# EasyEDA schematic Biped Motor Control Board.json
TITLE: Sheet_1; REV: 1.0; Date: 2019-03-02; Sheet: 1/1; Drawn By: anand1997; Company: Your Company
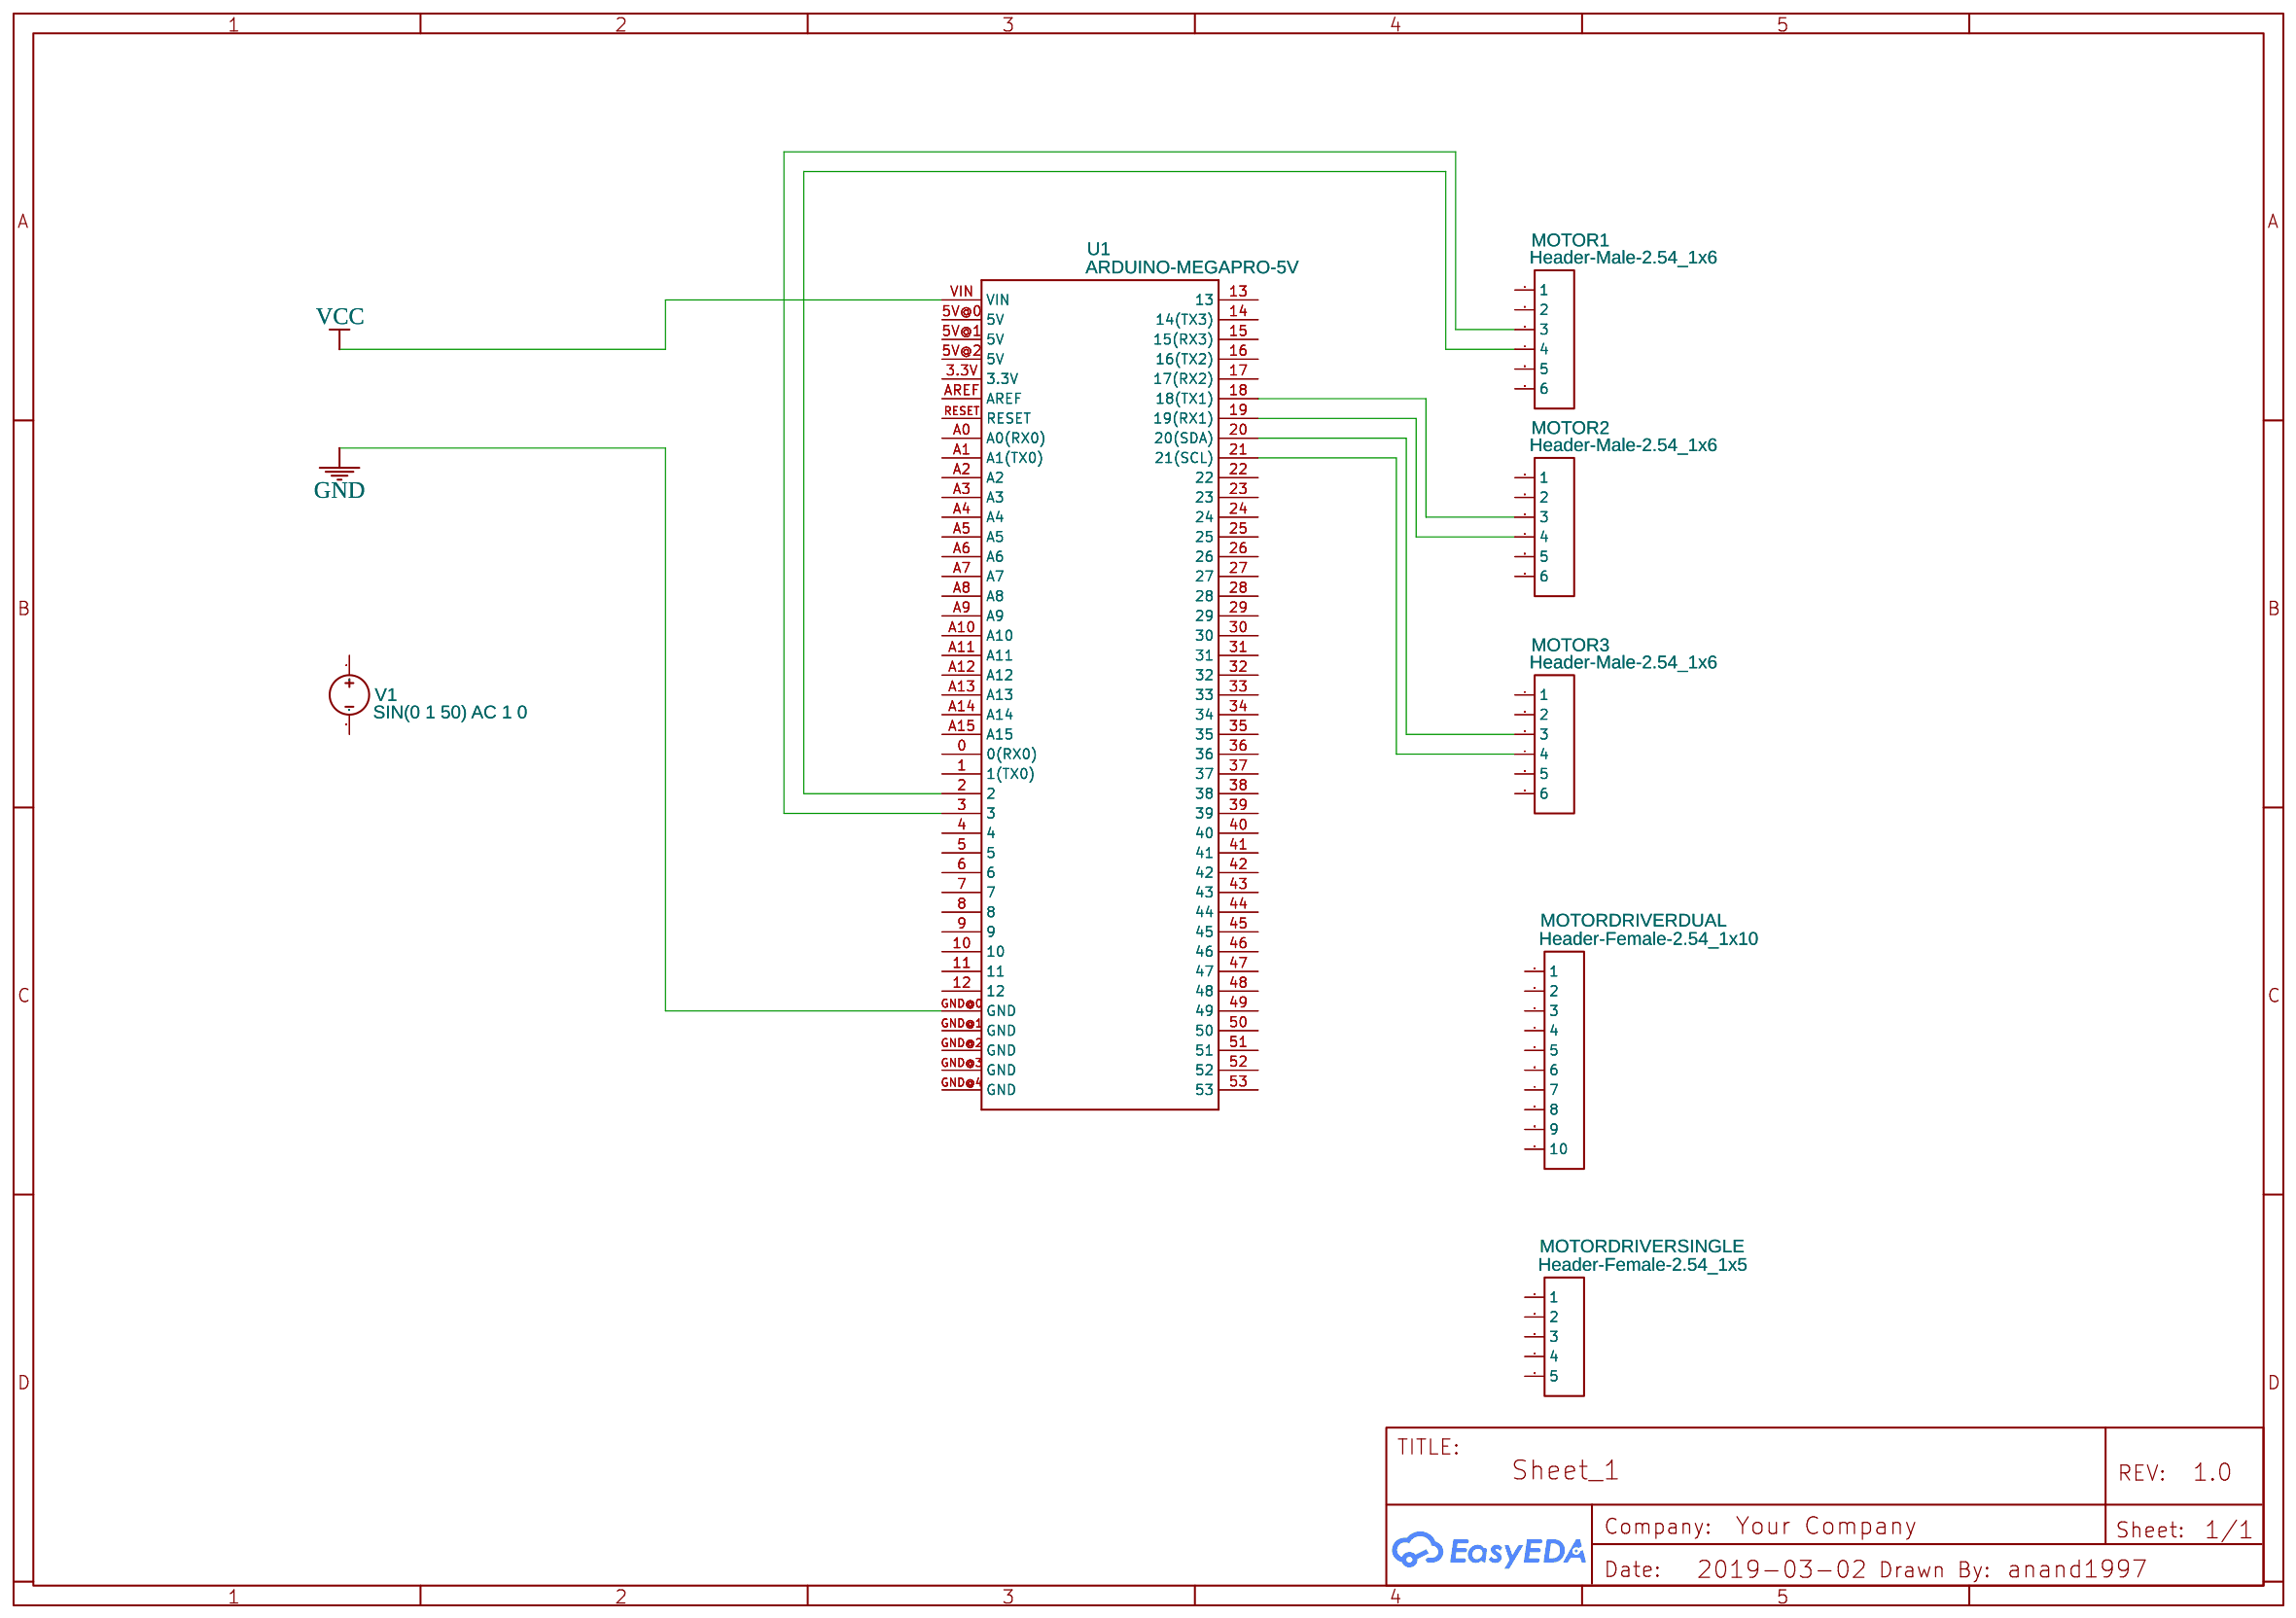
[diagram p0: schematic sheet]

## Parts
MOTOR1  Header-Male-2.54_1x6  [HDR-6X1/2.54]
MOTOR2  Header-Male-2.54_1x6  [HDR-6X1/2.54]
MOTOR3  Header-Male-2.54_1x6  [HDR-6X1/2.54]
MOTORDRIVERDUAL  Header-Female-2.54_1x10  [HDR-10X1/2.54]
MOTORDRIVERSINGLE  Header-Female-2.54_1x5  [HDR-5X1/2.54]
U1  ARDUINO-MEGAPRO-5V  [ARDUINO_MEGA-PRO-5V]
V1  SIN(0 1 50) AC 1 0  [HDR1X2]

## Library data of the parts
MOTOR1-MOTOR3 = -: Supplier: LCSC; Manufacturer: BOOMELE; Supplier Part: C37208
MOTORDRIVERDUAL = -: Supplier: LCSC; Manufacturer: BOOMELE; Manufacturer Part: 2.54mm 1*10P Straight Female header Gold-plated; Supplier Part: C35445
MOTORDRIVERSINGLE = -: Supplier: LCSC; Manufacturer: BOOMELE; Manufacturer Part: 2.54mm 1*5p Female header; image: //image.lceda.cn/szlcsc/C50950.jpg; Supplier Part: C50950
U1 = -: Arduino Mega board footprint; Contributor: SparkFun; Manufacturer Part: ?
V1 = Vsin: Manufacturer Part: ?

## Nets
GND: U1.GND@0(GND)
VCC: U1.VIN
Net-(MOTOR1-3): MOTOR1.3 U1.3
Net-(MOTOR1-4): MOTOR1.4 U1.2
Net-(MOTOR2-3): MOTOR2.3 U1.18(18(TX1))
Net-(MOTOR2-4): MOTOR2.4 U1.19(19(RX1))
Net-(MOTOR3-3): MOTOR3.3 U1.20(20(SDA))
Net-(MOTOR3-4): MOTOR3.4 U1.21(21(SCL))

Not connected (* = marked no-connect by the designer): MOTOR1 1 2 5 6; MOTOR2 1 2 5 6; MOTOR3 1 2 5 6; MOTORDRIVERDUAL 1 2 3 4 5 6 7 8 9 10; MOTORDRIVERSINGLE 1 2 3 4 5; U1 0(0(RX0)) 1(1(TX0)) 3.3V 4 5 5V@0(5V) 5V@1(5V) 5V@2(5V) 6 7 8 9 10 11 12 13 14(14(TX3)) 15(15(RX3)) 16(16(TX2)) 17(17(RX2)) 22 23 24 25 26 27 28 29 30 31 32 33 34 35 36 37 38 39 40 41 42 43 44 45 46 47 48 49 50 51 52 53 A0(A0(RX0)) A1(A1(TX0)) A2 A3 A4 A5 A6 A7 A8 A9 A10 A11 A12 A13 A14 A15 AREF GND@1(GND) GND@2(GND) GND@3(GND) GND@4(GND) RESET; V1 1 2
